# Altium project oxi_dev2.PrjPcb
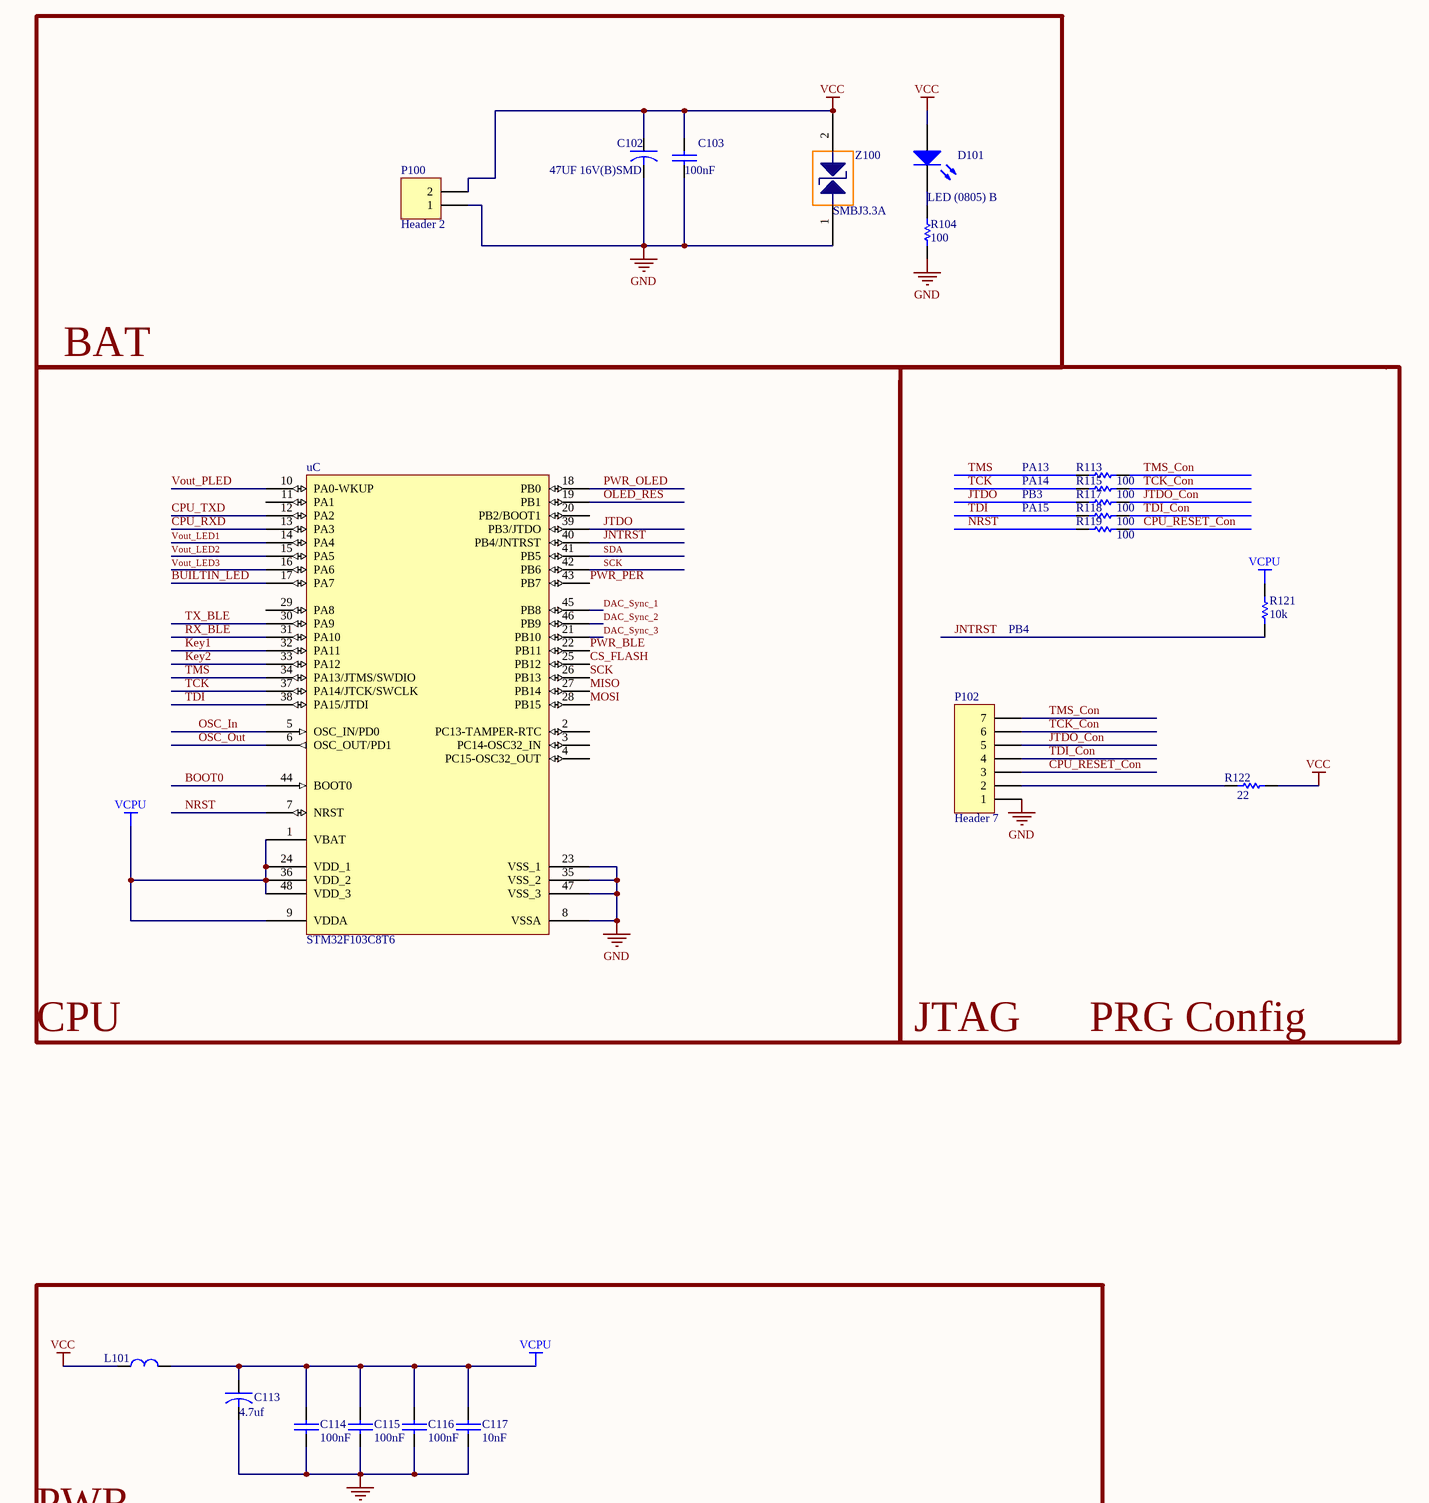
[diagram p0: oxi_dev2.SchDoc, top left]
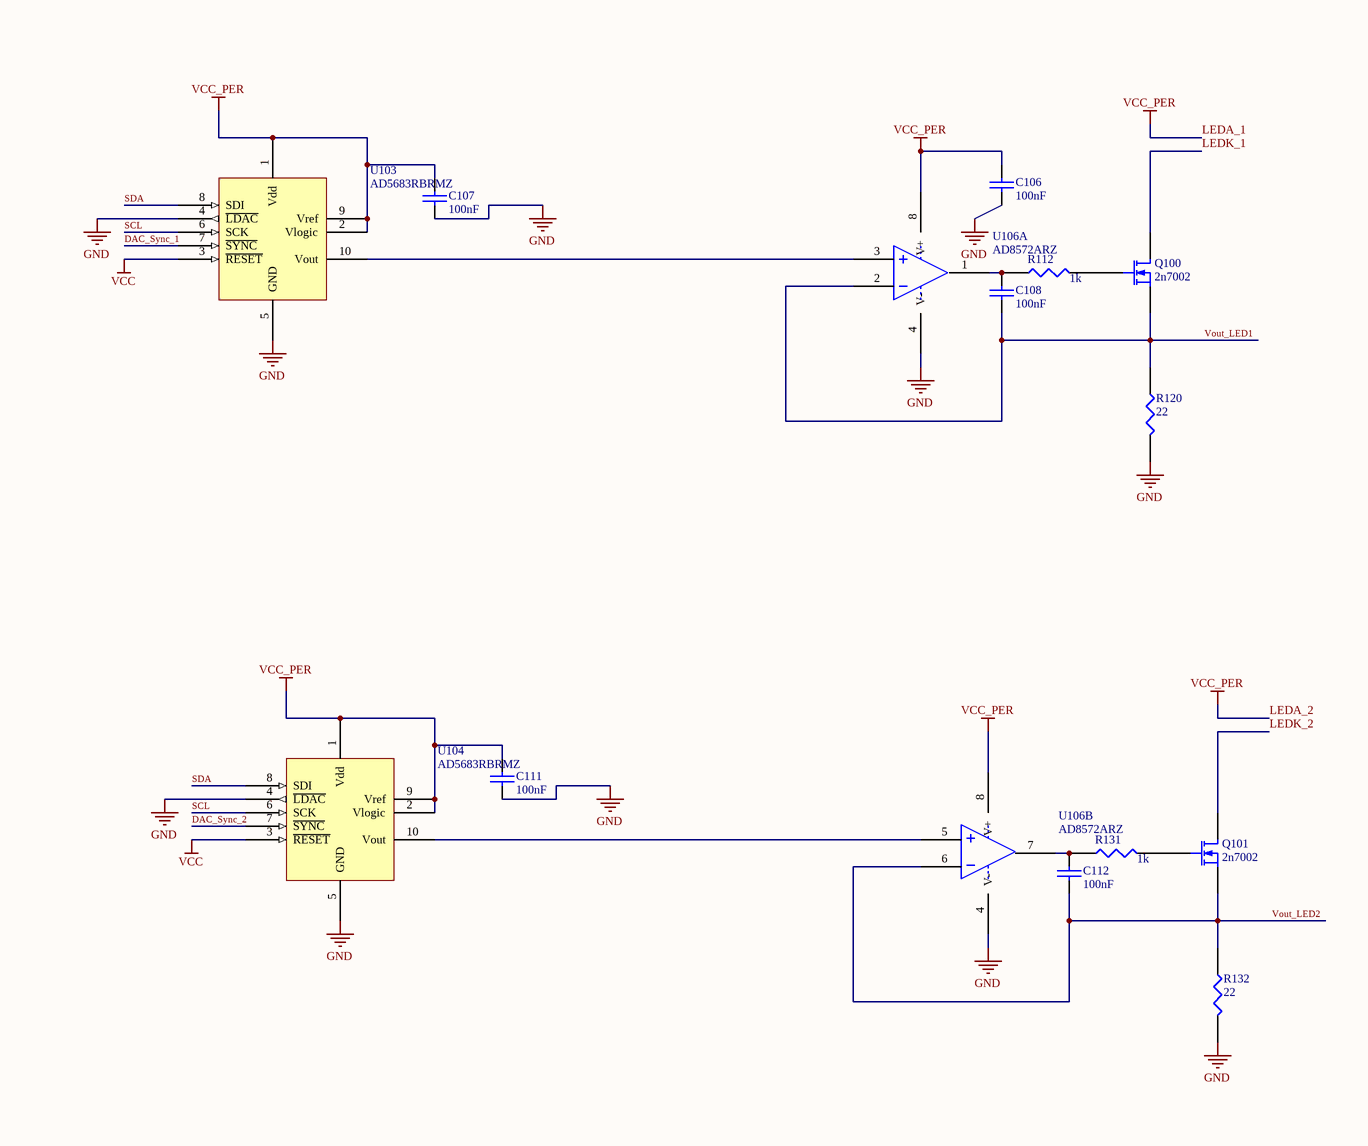
[diagram p1: oxi_dev2.SchDoc, top middle]
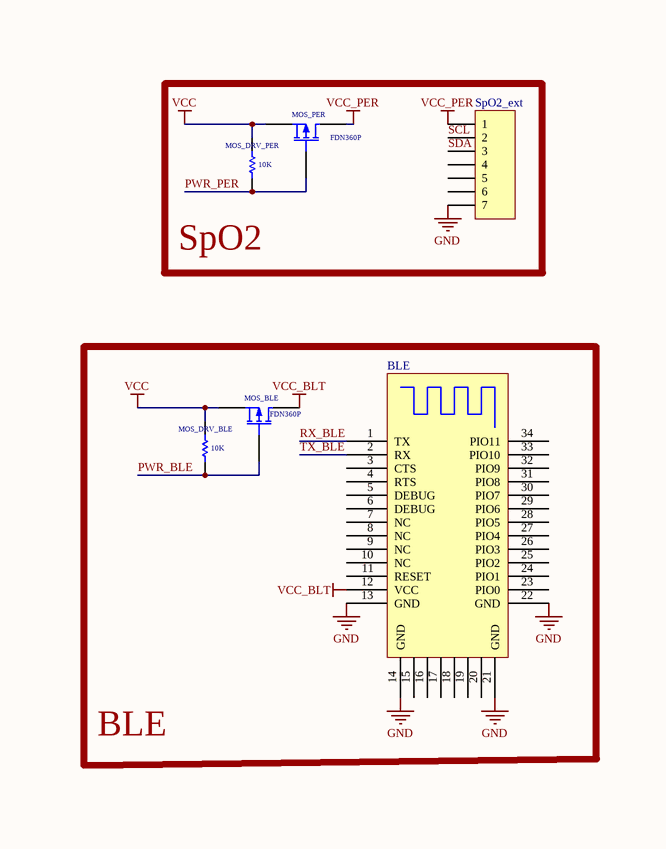
[diagram p2: oxi_dev2.SchDoc, top right]
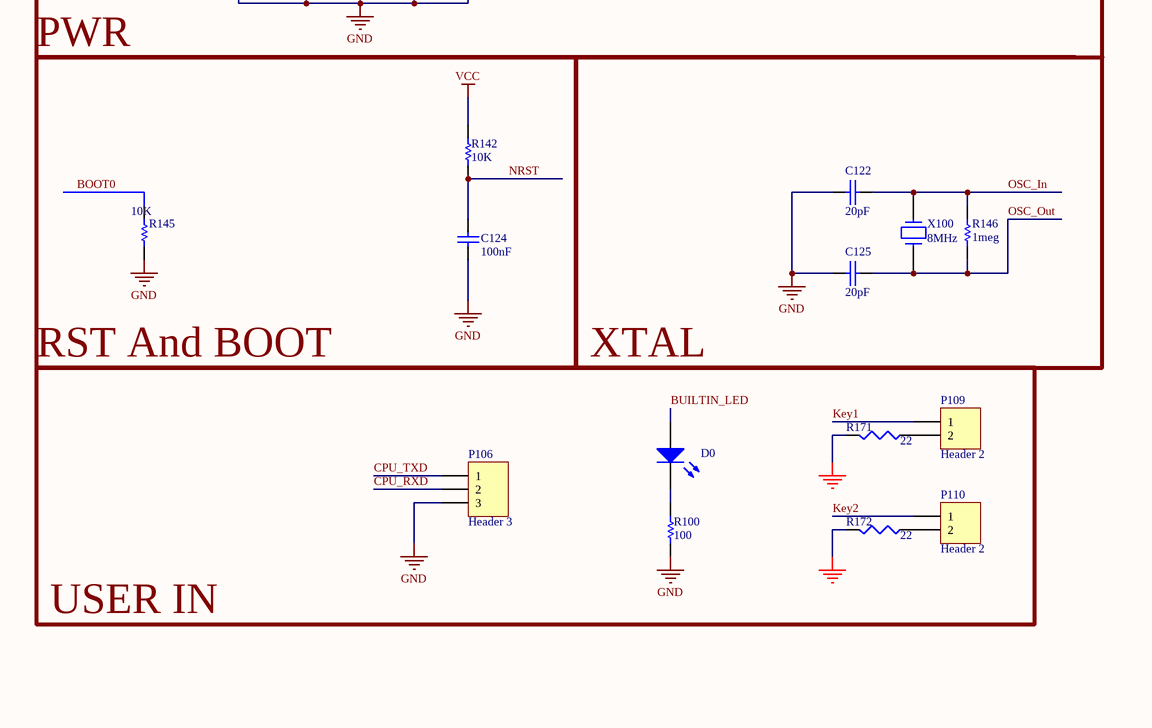
[diagram p3: oxi_dev2.SchDoc, bottom left]
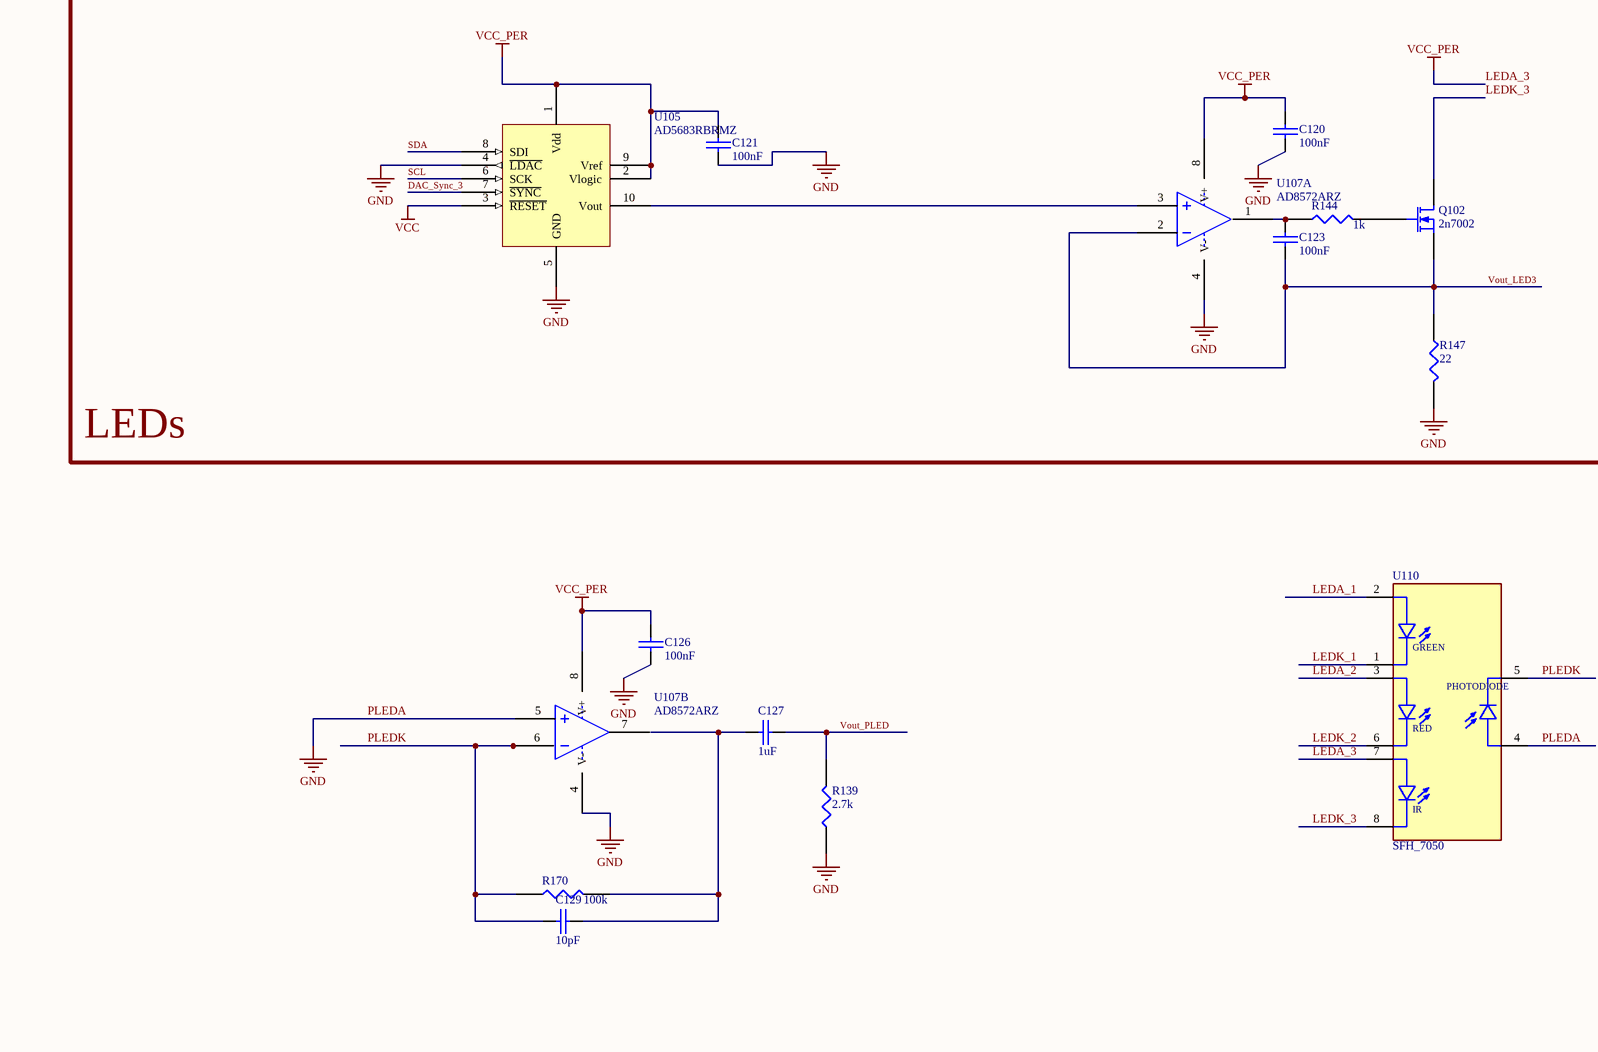
[diagram p4: oxi_dev2.SchDoc, bottom middle]
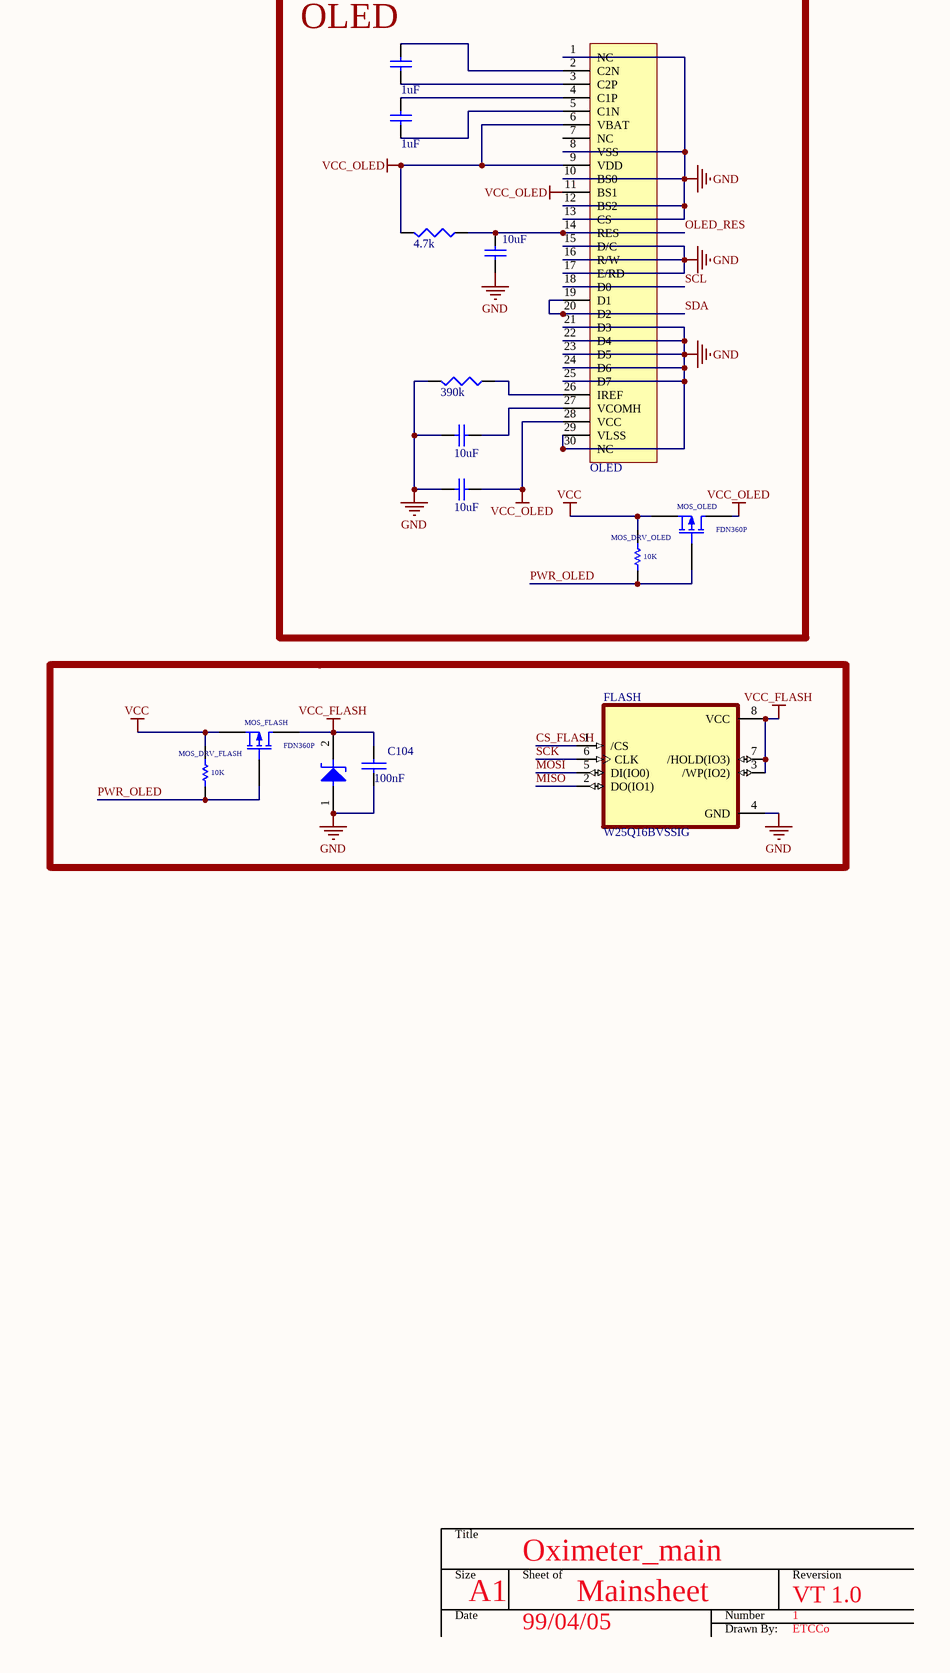
[diagram p5: oxi_dev2.SchDoc, bottom right]
1 sheet, 84 parts. Net scope: global (net labels, ports and power ports of the same name join across sheets).
Board file: oxi_dev2.PcbDoc

## Sheet oxi_dev2.SchDoc
size A1

### Parts
BLE  HM-16  [HM-16]  (value not drawn)
BRIGHTNESS_RES  value 390k  [SMD-0603-RES]  (hidden comment: Res3)
C102  47UF 16V(B)SMD  [SMD-0603-RES]
C103  100nF  [SMD-0603-RES]
C104  100nF  [SMD-0603-RES]
C106  100nF  [SMD-0603-RES]
C107  100nF  [SMD-0603-RES]
C108  100nF  [SMD-0603-RES]
C111  100nF  [SMD-0603-RES]
C112  100nF  [SMD-0603-RES]
C113  4.7uf  [SMD-0603-RES]
C114  100nF  [SMD-0603-RES]
C115  100nF  [SMD-0603-RES]
C116  100nF  [SMD-0603-RES]
C117  10nF  [SMD-0603-RES]
C120  100nF  [SMD-0603-RES]
C121  100nF  [SMD-0603-RES]
C122  20pF  [SMD-0603-RES]
C123  100nF  [SMD-0603-RES]
C124  100nF  [SMD-0603-RES]
C125  20pF  [SMD-0603-RES]
C126  100nF  [SMD-0603-RES]
C127  1uF  [SMD-0603-RES]
C129  10pF  [SMD-0603-RES]
C_PUMP_1  value 1uF  [SMD-0603-RES]  (hidden comment: Cap Semi)
C_PUMP_2  value 1uF  [SMD-0603-RES]  (hidden comment: Cap Semi)
C_PUMP_VCMON  value 10uF  [SMD-0603-RES]  (hidden comment: Cap Semi)
D0  LED (0805) B  [3.2X1.6X1.1]  (value not drawn)
D101  LED (0805) B  [SMD-0603-RES]
FLASH  W25Q16BVSSIG  [SOIC127P790X216-8N]
L101  EBLS2012-101K  [SMD-0603-RES]  (value not drawn)
MOS_BLE  FDN360P  [SOT23_N]
MOS_DRV_BLE  10K  [SMD-0603-RES]
MOS_DRV_FLASH  10K  [SMD-0603-RES]
MOS_DRV_OLED  10K  [SMD-0603-RES]
MOS_DRV_PER  10K  [SMD-0603-RES]
MOS_FLASH  FDN360P  [SOT23_N]
MOS_OLED  FDN360P  [SOT23_N]
MOS_PER  FDN360P  [SOT23_N]
OLED  OLED  [OLED0.96_NO3D]  (value not drawn)
OLED_C_STABILITY  value 10uF  [SMD-0603-RES]  (hidden comment: Cap Semi)
OLED_RES_PU  value 4.7k  [SMD-0603-RES]  (hidden comment: Res3)
P100  Header 2  [HDR1X2]
P102  Header 7  [HDR1X7]
P106  Header 3  [HDR1X3]
P109  Header 2  [PUSH_BTN]
P110  Header 2  [PUSH_BTN]
Q100  2n7002  [SOT23_N]
Q101  2n7002  [SOT23_N]
Q102  2n7002  [SOT23_N]
R100  100  [SMD-0603-RES]
R104  100  [SMD-0603-RES]
R112  1k  [SMD-0603-RES]
R113  100  [SMD-0603-RES]
R115  100  [SMD-0603-RES]
R117  100  [SMD-0603-RES]
R118  100  [SMD-0603-RES]
R119  100  [SMD-0603-RES]
R120  22  [SMD-0603-RES]
R121  10k  [SMD-0603-RES]
R122  22  [SMD-0603-RES]
R131  1k  [SMD-0603-RES]
R132  22  [SMD-0603-RES]
R139  2.7k  [SMD-0603-RES]
R142  10K  [SMD-0603-RES]
R144  1k  [SMD-0603-RES]
R145  10K  [SMD-0603-RES]
R146  1meg  [SMD-0603-RES]
R147  22  [SMD-0603-RES]
R170  100k  [SMD-0603-RES]
R171  22  [SMD-0603-RES]
R172  22  [SMD-0603-RES]
RES_BYPASS  value 10uF  [SMD-0603-RES]  (hidden comment: Cap Semi)
SpO2_ext  Header 7  [HDR1X7]  (value not drawn)
U103  AD5683RBRMZ  [SOP50P490X110-10N]
U104  AD5683RBRMZ  [SOP50P490X110-10N]
U105  AD5683RBRMZ  [SOP50P490X110-10N]
U106  AD8572ARZ  [SO-8_N]  (parts A,B of 2)
U107  AD8572ARZ  [SO-8_N]  (parts A,B of 2)
U110  SFH_7050  [XDCR_SFH_7050]
uC  STM32F103C8T6  [LQFP48_N]
X100  8MHz  [R38]
Z100  SMBJ3.3A  [smb]
ZEN_USB  5V  [SMD-0603-RES]  (value not drawn)

### Blocks framed on the sheet
BAT: C102 C103 D101 P100 R104 Z100
LEDs: C106-C108 C111 C112 C120 C121 C123 Q100-Q102 R112 R120 R131 R132 R144 R147 U103-U107
BLE: BLE MOS_BLE MOS_DRV_BLE
PWR: C113-C117 L101
OLED: BRIGHTNESS_RES C_PUMP_1 C_PUMP_2 C_PUMP_VCMON MOS_DRV_OLED MOS_OLED OLED OLED_C_STABILITY OLED_RES_PU RES_BYPASS

### Nets
LEDA_1: C106.1 C107.1 C111.1 C120.1 C121.1 C126.1 MOS_PER.3(D) SpO2_ext.1 U103.1(Vdd) U103.2(Vlogic) U103.9(Vref) U104.1(Vdd) U104.2(Vlogic) U104.9(Vref) U105.1(Vdd) U105.2(Vlogic) U105.9(Vref) U106.8(V+) U107.8(V+) U110.2(GA) U110.3(RA) U110.7(IA)  [also labelled LEDA_2, LEDA_3, VCC_PER]
PLEDA: BLE.13(GND) BLE.14(GND) BLE.21(GND) BLE.22(GND) BRIGHTNESS_RES.2 C102.1 C103.2 C104.2 C106.2 C107.2 C111.2 C113.2 C114.2 C115.2 C116.2 C117.2 C120.2 C121.2 C122.2 C124.1 C125.2 C126.2 C_PUMP_VCMON.2 FLASH.4(GND) OLED.1(NC) OLED.8(VSS) OLED.10(BS0) OLED.12(BS2) OLED.13(CS) OLED.15(D/C) OLED.16(R/W) OLED.17(E/RD) OLED.21(D3) OLED.22(D4) OLED.23(D5) OLED.24(D6) OLED.25(D7) OLED.29(VLSS) OLED.30(NC) OLED_C_STABILITY.2 P100.1 P102.1 P106.3 R100.1 R104.1 R120.2 R132.2 R139.1 R145.2 R147.2 R171.2 R172.2 RES_BYPASS.1 SpO2_ext.7 U103.4(~{LDAC}) U103.5(GND) U104.4(~{LDAC}) U104.5(GND) U105.4(~{LDAC}) U105.5(GND) U106.4(V-) U107.4(V-) U107.5(IN+) U110.4(PA) uC.8(VSSA) uC.23(VSS_1) uC.35(VSS_2) uC.47(VSS_3) Z100.1 ZEN_USB.1  [also labelled GND]
VCC: C102.2 C103.1 D101.1(A) L101.1 MOS_BLE.2(S) MOS_DRV_BLE.1 MOS_DRV_FLASH.1 MOS_DRV_OLED.1 MOS_DRV_PER.1 MOS_FLASH.2(S) MOS_OLED.2(S) MOS_PER.2(S) P100.2 R122.2 R142.2 U103.3(~{RESET}) U104.3(~{RESET}) U105.3(~{RESET}) Z100.2
VCC_BLT: BLE.12(VCC) MOS_BLE.3(D)
VCC_FLASH: C104.1 FLASH.3(/WP(IO2)) FLASH.7(/HOLD(IO3)) FLASH.8(VCC) MOS_FLASH.3(D) ZEN_USB.2
VCC_OLED: MOS_OLED.3(D) OLED.6(VBAT) OLED.9(VDD) OLED.11(BS1) OLED.28(VCC) OLED_C_STABILITY.1 OLED_RES_PU.2
VCPU: C113.1 C114.1 C115.1 C116.1 C117.1 L101.2 R121.1 uC.1(VBAT) uC.9(VDDA) uC.24(VDD_1) uC.36(VDD_2) uC.48(VDD_3)
BOOT0: R145.1 uC.44(BOOT0)
BUILTIN_LED: D0.1(A) uC.17(PA7)
CPU_~{RESE}T_Co~{n}: P102.3 R119.1
CPU_RXD: P106.2 uC.13(PA3)
CPU_TXD: P106.1 uC.12(PA2)
CS_FLASH: FLASH.1(/CS) uC.25(PB12)
DAC_Sync_1: U103.7(~{SYNC}) uC.45(PB8)
DAC_Sync_2: U104.7(~{SYNC}) uC.46(PB9)
DAC_Sync_3: U105.7(~{SYNC}) uC.21(PB10)
JNTRST: R121.2 uC.40(PB4/JNTRST)
JTDO: R117.2 uC.39(PB3/JTDO)
JTDO_Con: P102.5 R117.1
Key1: P109.1 uC.32(PA11)
Key2: P110.1 uC.33(PA12)
LEDK_1: Q100.3(D) U110.1(GC)
LEDK_2: Q101.3(D) U110.6(RC)
LEDK_3: Q102.3(D) U110.8(IC)
MISO: FLASH.2(DO(IO1)) uC.27(PB14)
MOSI: FLASH.5(DI(IO0)) uC.28(PB15)
NRST: C124.2 R119.2 R142.1 uC.7(NRST)
OLED_RES: OLED.14(RES) OLED_RES_PU.1 RES_BYPASS.2 uC.19(PB1)
OSC_In: C122.1 R146.1 uC.5(OSC_IN/PD0) X100.2
OSC_Out: C125.1 R146.2 uC.6(OSC_OUT/PD1) X100.1
PLEDK: C129.1 R170.1 U107.6(IN-) U110.5(PC)
PWR_BLE: MOS_BLE.1(G) MOS_DRV_BLE.2 uC.22(PB11)
PWR_OLED: MOS_DRV_FLASH.2 MOS_DRV_OLED.2 MOS_FLASH.1(G) MOS_OLED.1(G) uC.18(PB0)
PWR_PER: MOS_DRV_PER.2 MOS_PER.1(G) uC.43(PB7)
RX_BLE: BLE.1(TX) uC.31(PA10)
SCK: FLASH.6(CLK) uC.26(PB13) uC.42(PB6)
SCL: OLED.18(D0) SpO2_ext.2 U103.6(SCK) U104.6(SCK) U105.6(SCK)
SDA: OLED.19(D1) OLED.20(D2) SpO2_ext.3 U103.8(SDI) U104.8(SDI) U105.8(SDI) uC.41(PB5)
TCK: R115.2 uC.37(PA14/JTCK/SWCLK)
TCK_Con: P102.6 R115.1
TDI: R118.2 uC.38(PA15/JTDI)
TDI_Con: P102.4 R118.1
TMS: R113.2 uC.34(PA13/JTMS/SWDIO)
TMS_Con: P102.7 R113.1
TX_BLE: BLE.2(RX) uC.30(PA9)
Vout_LED1: C108.2 Q100.2(S) R120.1 U106.2(IN-) uC.14(PA4)
Vout_LED2: C112.2 Q101.2(S) R132.1 U106.6(IN-) uC.15(PA5)
Vout_LED3: C123.2 Q102.2(S) R147.1 U107.2(IN-) uC.16(PA6)
Vout_PLED: C127.2 R139.2 uC.10(PA0-WKUP)
NetBRIGHTNESS_RES_1: BRIGHTNESS_RES.1 OLED.26(IREF)
NetC108_1: C108.1 R112.1 U106.1(OUT)
NetC112_1: C112.1 R131.1 U106.7(OUT)
NetC123_1: C123.1 R144.1 U107.1(OUT)
NetC127_1: C127.1 C129.2 R170.2
NetC_PUMP_1_1: C_PUMP_1.1 OLED.3(C2P)
NetC_PUMP_1_2: C_PUMP_1.2 OLED.2(C2N)
NetC_PUMP_2_1: C_PUMP_2.1 OLED.5(C1N)
NetC_PUMP_2_2: C_PUMP_2.2 OLED.4(C1P)
NetC_PUMP_VCMON_1: C_PUMP_VCMON.1 OLED.27(VCOMH)
NetD0_2: D0.2(K) R100.2
NetD101_2: D101.2(K) R104.2
NetP102_2: P102.2 R122.1
NetP109_2: P109.2 R171.1
NetP110_2: P110.2 R172.1
NetQ100_1: Q100.1(G) R112.2
NetQ101_1: Q101.1(G) R131.2
NetQ102_1: Q102.1(G) R144.2
NetU103_10: U103.10(Vout) U106.3(IN+)
NetU104_10: U104.10(Vout) U106.5(IN+)
NetU105_10: U105.10(Vout) U107.3(IN+)

Not connected (* = marked no-connect by the designer): BLE 3(CTS) 4(RTS) 5(DEBUG) 6(DEBUG) 7(NC) 8(NC) 9(NC) 10(NC) 11(RESET) 15 16 17 18 19 20 23(PIO0) 24(PIO1) 25(PIO2) 26(PIO3) 27(PIO4) 28(PIO5) 29(PIO6) 30(PIO7) 31(PIO8) 32(PIO9) 33(PIO10) 34(PIO11); OLED 7(NC); SpO2_ext 4 5 6; U107 7(OUT); uC 2(PC13-TAMPER-RTC) 3(PC14-OSC32_IN) 4(PC15-OSC32_OUT) 11(PA1) 20(PB2/BOOT1) 29(PA8)

### Notes on the sheet
- PA13
- PB3
- PA15
- PA14
- (near MOS_DRV_PER) SpO2
- PB4
- CPU
- JTAG
- PRG Config
- RST And BOOT
- XTAL
- USER IN
- Title
- Oximeter_main
- Size
- Date
- A1
- Sheet of
- 99/04/05
- Mainsheet
- Number
- Drawn By:
- Reversion
- ETCCo
- VT 1.0
- 1
- (in symbol SFH_7050) GREEN; PHOTODIODE; RED; IR

### Library data of the parts
BRIGHTNESS_RES OLED_RES_PU = Res3: Resistor; Published: 8-Jun-2000; LatestRevisionDate: 29-May-2009; LatestRevisionNote: IPC-7351 Footprint Added.; PackageReference: J1-0603; Publisher: Altium Limited; PackageDescription: Chip Resistor
C102 = CAPACITOR: TAJD106M035RNJ
C103 C104 C106-C108 C111 C112 C114-C117 C120-C123 C125-C127 C129 = CAP: Capacitor
C113 = CAPACITOR: TAJA106M010RNJ: 10UF/10V
C124 = CAP: Capacitor; Value: 100pF; Published: 8-Jun-2000; Revision: July-2002: Re-released for DXP Platform.; Publisher: Altium Limited
C_PUMP_1 C_PUMP_2 C_PUMP_VCMON OLED_C_STABILITY RES_BYPASS = Cap Semi: Capacitor (Semiconductor SIM Model); Published: 8-Jun-2000; LatestRevisionDate: 29-May-2009; LatestRevisionNote: IPC-7351 Footprint Added.; PackageReference: C1206; Publisher: Altium Limited; PackageDescription: Chip Capacitor
D0 D101 = LED3: Typical BLUE SiC LED; Published: 8-Jun-2000; LatestRevisionDate: 17-Dec-2003; LatestRevisionNote: PCB Footprint replaced.; DatasheetDocument: 16-Apr-2002; PackageDocument: 16-Apr-2002; PackageReference: 3.5X2.8X1.9; Publisher: Altium Limited
FLASH = W25Q16BVSSIG: FLASH - NOR Memory IC 16Mb _2M x 8_ SPI 104MHz 8-SOIC; MF: Winbond; Availability: Unavailable; MP: W25Q16BVSSIG; SnapEDA_Link: https://www.snapeda.com/parts/W25Q16BVSSIG/Winbond%20Electronics/view-part/512685/?ref=snap; Value: *; Price: None; Package: SOIC-8 Winbond
L101 = INDUCTOR: Inductor 100UH (0805); GLFR1608T100M-LR: 10UH
MOS_BLE MOS_FLASH MOS_OLED MOS_PER = MOSFET-P: P-Channel MOSFET; Published: 8-Jun-2000; LatestRevisionDate: 17-Jul-2002; LatestRevisionNote: Re-released for DXP Platform.; PackageVersion: 1995/1996; PackageReference: E3; Publisher: Altium Limited; PackageDescription: TO, Flat Index; 3 In-Line, Axial Leads; Body Dia. 4.6mm; Lead Dia. 0.5 mm (max)
MOS_DRV_BLE MOS_DRV_FLASH MOS_DRV_OLED MOS_DRV_PER R142 = res1: Resistor; Value: 1K; Published: 8-Jun-2000; Revision: July-2002: Re-released for DXP Platform.; Publisher: Altium Limited
OLED = OLED0.96
P100 P109 P110 = Header 2: Header, 2-Pin; LatestRevisionDate: 17-Jul-2002; LatestRevisionNote: Re-released for DXP Platform.; Publisher: Altium Limited
P102 SpO2_ext = Header 7: Header, 7-Pin; LatestRevisionDate: 17-Jul-2002; LatestRevisionNote: Re-released for DXP Platform.; Publisher: Altium Limited
P106 = Header 3: Header, 3-Pin; LatestRevisionDate: 17-Jul-2002; LatestRevisionNote: Re-released for DXP Platform.; Publisher: Altium Limited
Q100-Q102 = MOSFET-N: N-Channel MOSFET; Published: 8-Jun-2000; LatestRevisionDate: 17-Jul-2002; LatestRevisionNote: Re-released for DXP Platform.; PackageVersion: 1995/1996; PackageReference: E3; Publisher: Altium Limited; PackageDescription: TO, Flat Index; 3 In-Line, Axial Leads; Body Dia. 4.6mm; Lead Dia. 0.5 mm (max)
R100 R104 R113 R115 R117-R119 R121 R122 R145 R146 = Res1: Resistor; Value: 1K; Published: 8-Jun-2000; Revision: July-2002: Re-released for DXP Platform.; Publisher: Altium Limited
R112 R120 R131 R132 R139 R144 R147 R170-R172 = RES1
U103-U105 = AD5683RBRMZ: Tiny 16-/14-/12-Bit SPI nanoDAC+, with  ±2 (16-Bit) LSB INL and 2 ppm/°C Reference
U106 U107 = NJM3404
U110 = SFH_7050: Salida de voltaje del sensor de ox?­metro / frecuencia card?­aca; MF: OSRAM Opto; Digi-Key_Part_Number: 475-3346-1-ND; Digi-Key_Purchase_URL: https://www.digikey.com/product-detail/en/osram-opto-semiconductors-inc/SFH-7050/475-3346-1-ND/7645273?utm_source=snapeda&utm_medium=aggregator&utm_campaign=symbol; Package: None; MP: SFH 7050; Value: *; SnapEDA_Link: https://www.snapeda.com/parts/SFH%207050/OSRAM%20Opto%20Semiconductors%20Inc./view-part/227176/?ref=snap
uC = STM32F103C8T6: STM32 ARM-based 32-bit MCU with 64 Kbytes Flash, 48-pin LQFP, Industrial Temperature; Published: *; DatasheetVersion: *; PackageVersion: *; PackageReference: *; Publisher: *; PackageDescription: *; ComponentLink1Description: *; ComponentLink1URL: *; ComponentLink2Description: *; ComponentLink2URL: *
X100 = CRYSTAL: NTK-8.000000-HC49US
Z100 = A_TVS: 400W SURFACE MOUNT TVS
ZEN_USB = ZENER